# Altium schematic sheet Atomizer_medical.SchDoc
size A3
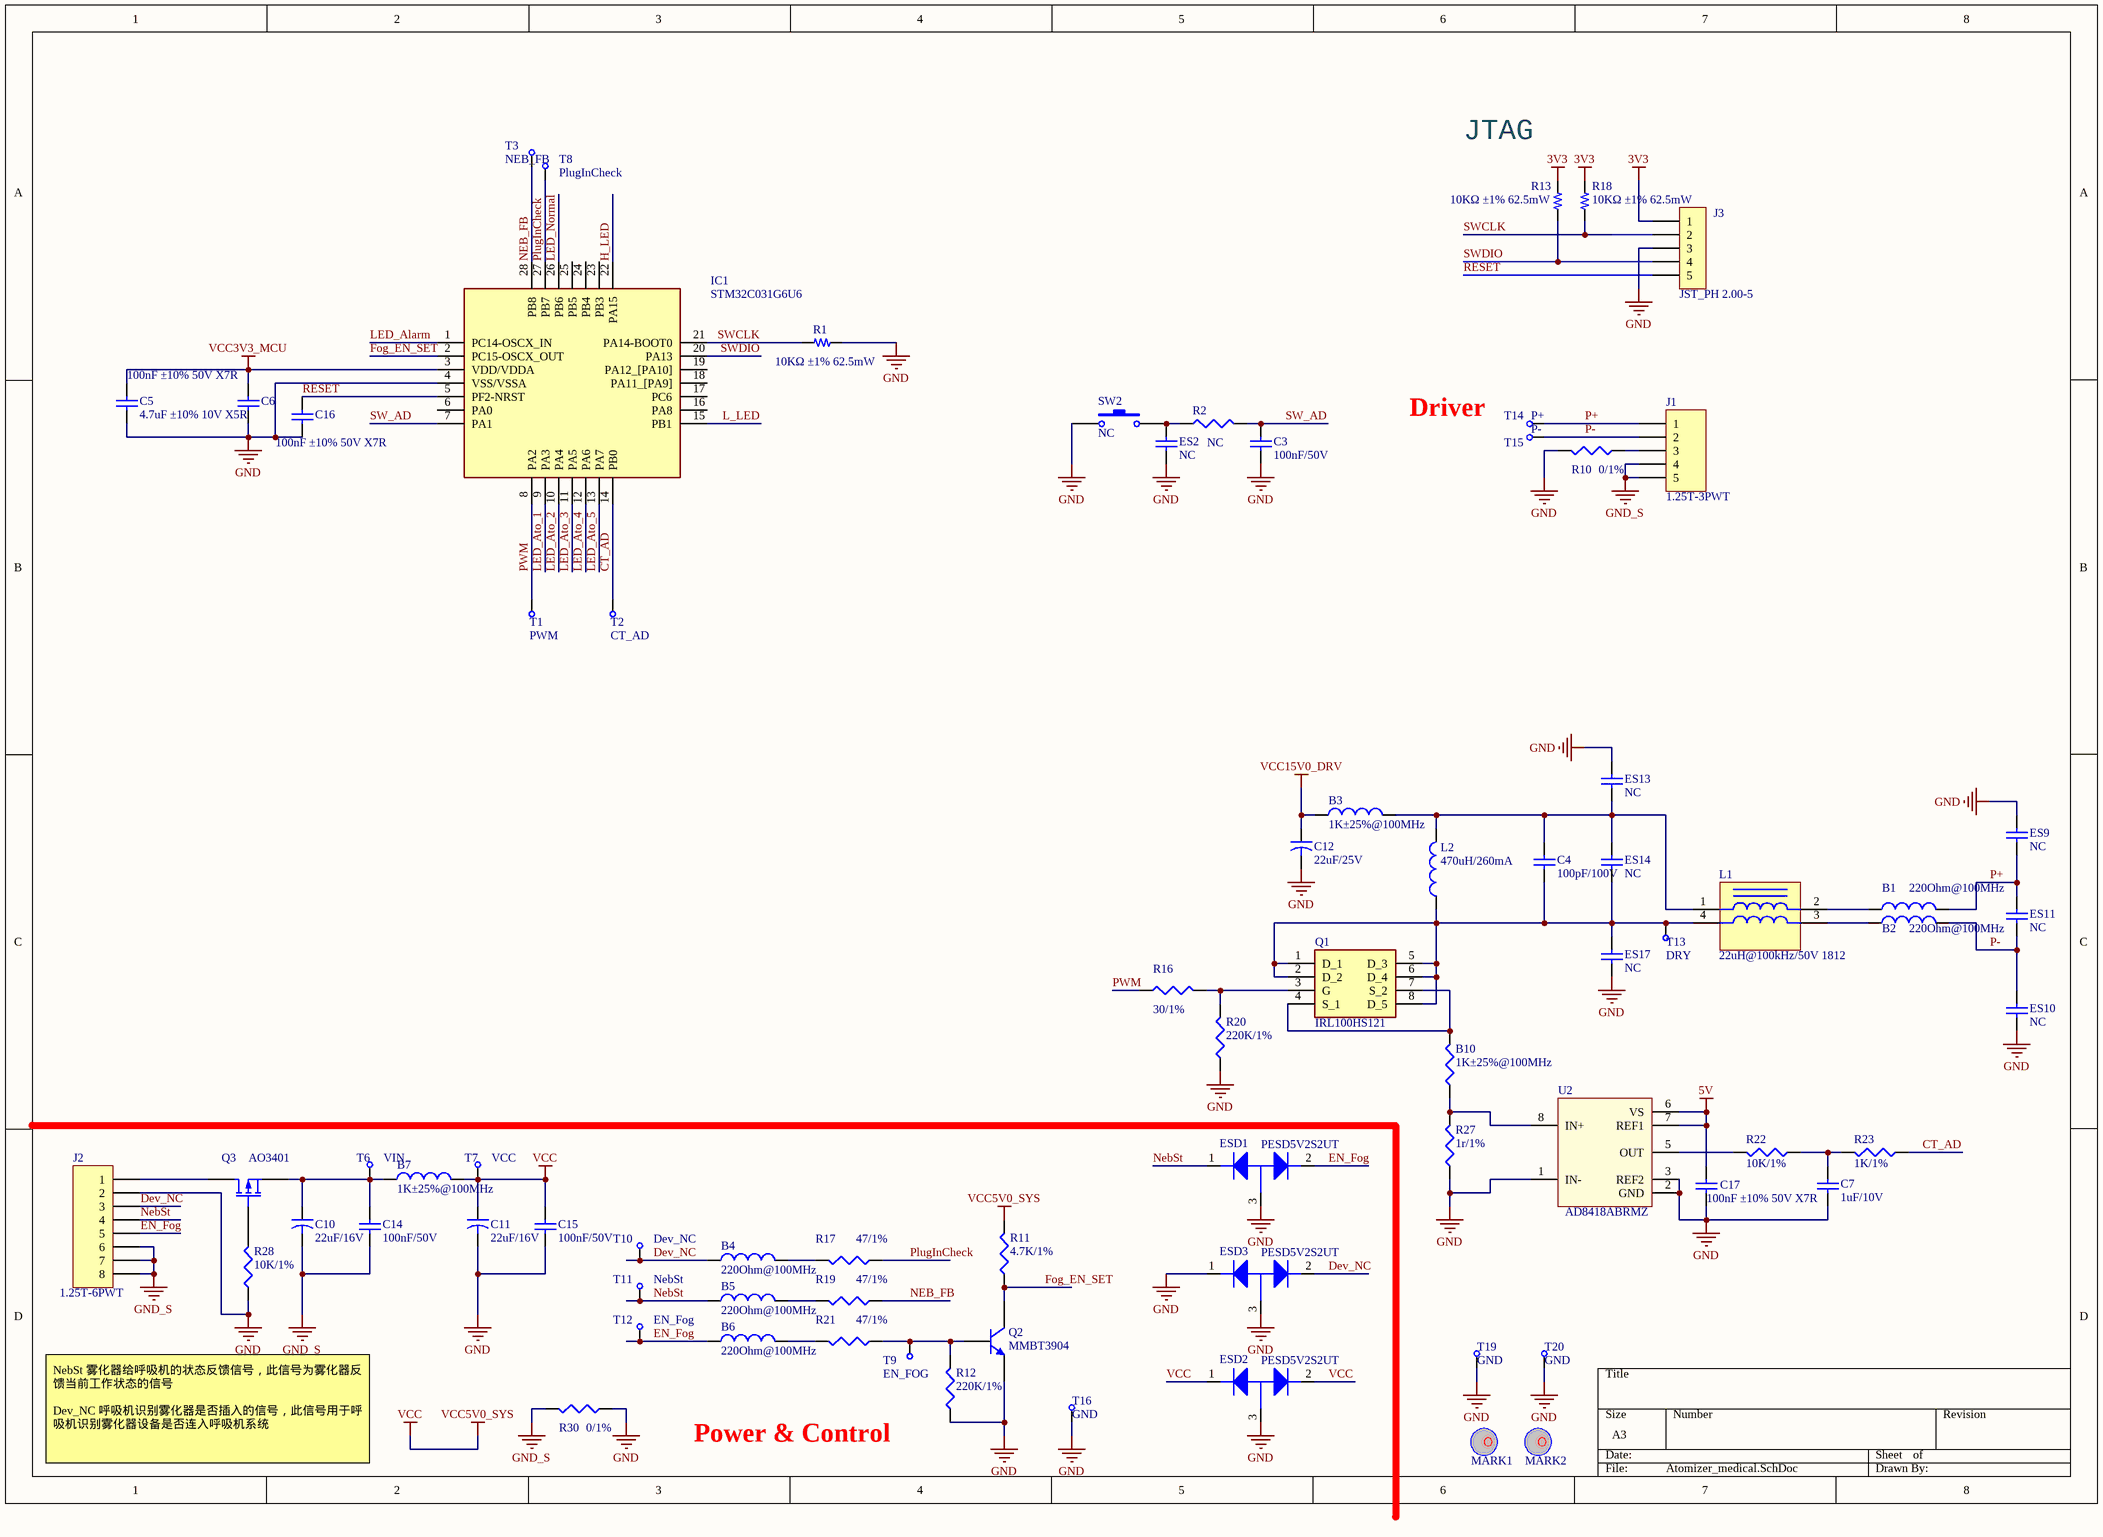
[diagram p0: Atomizer_medical.SchDoc]

## Parts
B1  220Ohm@100MHz  [0402-B]
B2  220Ohm@100MHz  [0402-B]
B3  1K±25%@100MHz  [0805-B]
B4  220Ohm@100MHz  [0402-B]
B5  220Ohm@100MHz  [0402-B]
B6  220Ohm@100MHz  [0402-B]
B7  1K±25%@100MHz  [0805-B]
B10  1K±25%@100MHz  [0603]
C3  100nF/50V  [0402-C]
C4  100pF/100V  [0805-C]
C5  4.7uF ±10% 10V X5R  [C0402]
C6  100nF ±10% 50V X7R  [C0402]
C7  1uF/10V  [0402-C]
C10  22uF/16V  [0805-C]
C11  22uF/16V  [0805-C]
C12  22uF/25V  [1206-C]
C14  100nF/50V  [0402-C]
C15  100nF/50V  [0402-C]
C16  100nF ±10% 50V X7R  [C0402]
C17  100nF ±10% 50V X7R  [C0402]
ES2  NC  [0402-C]
ES9  NC  [0402-C]
ES10  NC  [0402-C]
ES11  NC  [0402-C]
ES13  NC  [0402-C]
ES14  NC  [0402-C]
ES17  NC  [0402-C]
ESD1  PESD5V2S2UT  [SOT23]
ESD2  PESD5V2S2UT  [SOT23]
ESD3  PESD5V2S2UT  [SOT23]
IC1  STM32C031G6U6  [QFN50P400X400X60-28N-D]
J1  1.25T-3PWT  [WAFER_1.25MMX3P_180]
J2  1.25T-6PWT  [WAFER_1.25MMX6P_180]
J3  JST_PH 2.00-5  [JST_PH 2.00-5]
L1  22uH@100kHz/50V 1812  [LINEFILTER]
L2  470uH/260mA  [SP0502]
MARK1  MARK_POINT  [MARK_POINT]  (value not drawn)
MARK2  MARK_POINT  [MARK_POINT]  (value not drawn)
Q1  IRL100HS121  [IRL100HS121]
Q2  MMBT3904  [SOT23]
Q3  AO3401  [SOT23]
R1  10KΩ ±1% 62.5mW  [R0402]
R2  NC  [0402]
R10  0/1%  [0603]
R11  4.7K/1%  [0402]
R12  220K/1%  [0402]
R13  10KΩ ±1% 62.5mW  [R0402]
R16  30/1%  [0402]
R17  47/1%  [0402]
R18  10KΩ ±1% 62.5mW  [R0402]
R19  47/1%  [0402]
R20  220K/1%  [0402]
R21  47/1%  [0402]
R22  10K/1%  [0402]
R23  1K/1%  [0402]
R27  1r/1%  [0805]
R28  10K/1%  [0402]
R30  0/1%  [0603]
SW2  NC  [HTS-52MB]
T1  PWM  [TP-SIP-1-Small1]
T2  CT_AD  [TP-SIP-1-Small1]
T3  NEB_FB  [TP-SIP-1-Small1]
T6  VIN  [TP-SIP-1-Small1]
T7  VCC  [TP-SIP-1-Small1]
T8  PlugInCheck  [TP-SIP-1-Small1]
T9  EN_FOG  [TP-SIP-1-Small1]
T10  Dev_NC  [TP-SIP-1-Small1]
T11  NebSt  [TP-SIP-1-Small1]
T12  EN_Fog  [TP-SIP-1-Small1]
T13  DRY  [TP-SIP-1-Small1]
T14  P+  [TP-SIP-1-Small1]
T15  P-  [TP-SIP-1-Small1]
T16  GND  [TP-SIP-1-Small1]
T19  GND  [TP-SIP-1-Small1]
T20  GND  [TP-SIP-1-Small1]
U2  AD8418ABRMZ  [TSOP65P490X95-8N]

## Nets
3V3: J3.1 R13.2 R18.2
5V: C17.1 U2.6(VS) U2.7(REF1)
GND: C3.1 C5.1 C6.1 C7.2 C11.2 C12.2 C15.2 C16.1 C17.2 ES2.2 ES9.1 ES10.2 ES13.1 ES17.2 ESD1.3(G) ESD2.3(G) ESD3.1(S) ESD3.3(G) IC1.4(VSS/VSSA) J2.2 J3.3 Q2.2(E) R1.1 R10.2 R12.1 R20.1 R27.1 R28.1 R30.1 SW2.1 T16.1 T19.1 T20.1 U2.1(IN-) U2.2(GND) U2.3(REF2)
GND_S: C10.2 C14.2 J1.4 J1.5 J2.6 J2.7 J2.8 R30.2
VCC: B7.2 C11.1 C15.1 ESD2.1(S) ESD2.2(S) R11.2 T7.1  [also labelled VCC5V0_SYS]
VCC3V3_MCU: C5.2 C6.2 IC1.3(VDD/VDDA)
VCC15V0_DRV: B3.1 C12.1
CT_AD: IC1.14(PB0) R23.1 T2.1
Dev_NC: B4.1 ESD3.2(S) J2.3 T10.1
EN_Fog: B6.1 ESD1.2(S) J2.5 T12.1
Fog_EN_SET: IC1.2(PC15-OSCX_OUT) Q2.3(C) R11.1
H_LED: IC1.22(PA15)
L_LED: IC1.15(PB1)
LED_Alarm: IC1.1(PC14-OSCX_IN)
LED_Ato_1: IC1.9(PA3)
LED_Ato_2: IC1.10(PA4)
LED_Ato_3: IC1.11(PA5)
LED_Ato_4: IC1.12(PA6)
LED_Ato_5: IC1.13(PA7)
LED_Normal: IC1.26(PB6)
NEB_FB: IC1.28(PB8) R19.1 T3.1
NebSt: B5.1 ESD1.1(S) J2.4 T11.1
P+: B1.2 ES9.2 ES11.1 J1.1 T14.1
P-: B2.2 ES10.1 ES11.2 J1.2 T15.1
PlugInCheck: IC1.27(PB7) R17.1 T8.1
PWM: IC1.8(PA2) R16.1 T1.1
RESET: C16.2 IC1.5(PF2-NRST) J3.5
SW_AD: C3.2 IC1.7(PA1) R2.2
SWCLK: IC1.21(PA14-BOOT0) J3.2 R1.2 R18.1
SWDIO: IC1.20(PA13) J3.4 R13.1
NetB1_1: B1.1 L1.2
NetB2_1: B2.1 L1.3
NetB3_2: B3.2 C4.1 ES13.2 ES14.1 L1.1 L2.2
NetB4_2: B4.2 R17.2
NetB5_2: B5.2 R19.2
NetB6_2: B6.2 R21.2
NetB7_1: B7.1 C10.1 C14.1 Q3.3(S) T6.1
NetB10_1: B10.1 R27.2 U2.8(IN+)
NetB10_2: B10.2 Q1.4(S_1) Q1.7(S_2)
NetC4_2: C4.2 ES14.2 ES17.1 L1.4 L2.1 Q1.1(D_1) Q1.2(D_2) Q1.5(D_3) Q1.6(D_4) Q1.8(D_5) T13.1
NetC7_1: C7.1 R22.1 R23.2
NetES2_1: ES2.1 R2.1 SW2.2
NetJ1_3: J1.3 R10.1
NetJ2_1: J2.1 Q3.2(D)
NetQ1_3: Q1.3(G) R16.2 R20.2
NetQ2_1: Q2.1(B) R12.2 R21.1 T9.1
NetQ3_1: Q3.1(G) R28.2
NetR22_2: R22.2 U2.5(OUT)

Not connected (* = marked no-connect by the designer): IC1 6(PA0) 16(PA8) 17(PC6) 18(PA11_[PA9]) 19(PA12_[PA10]) 23(PB3) 24(PB4) 25(PB5)

## Notes on the sheet
- JTAG
- Driver
- NebSt 雾化器给呼吸机的状态反馈信号，此信号为雾化器反馈当前工作状态的信号
  Dev_NC 呼吸机识别雾化器是否插入的信号，此信号用于呼吸机识别雾化器设备是否连入呼吸机系统
- Power & Control

## Library data of the parts
B1-B7 L2 = Inductor: Code_IEC: 1005; Value: 10uH; Published: 8-Jun-2000; LatestRevisionDate: 29-May-2009; LatestRevisionNote: IPC-7351 Footprint Added.; PackageReference: 0402-A; Publisher: Altium Limited; PackageDescription: Chip Inductor; Code_JEITA: 0402
B10 R11 R12 R16 R17 R19-R23 R27 R28 = Res3: Resistor; Value: 1K; Published: 8-Jun-2000; LatestRevisionDate: 29-May-2009; LatestRevisionNote: IPC-7351 Footprint Added.; PackageReference: J1-0603; Publisher: Altium Limited; PackageDescription: Chip Resistor
C3 C4 C7 C14 C15 ES2 ES9-ES11 ES13 ES14 ES17 = Cap Semi: Capacitor (Semiconductor SIM Model); Value: 100pF; Published: 8-Jun-2000; LatestRevisionDate: 29-May-2009; LatestRevisionNote: IPC-7351 Footprint Added.; PackageReference: C1206; Publisher: Altium Limited; PackageDescription: Chip Capacitor
C5 = Cap: CL05A475KP5NRNC; Published: 8-Jun-2000; LatestRevisionDate: 17-Jul-2002; LatestRevisionNote: Re-released for DXP Platform.; PackageReference: RAD-0.3; Publisher: Altium Limited; PackageDescription: Radial Cap, Thru-Hole; 2 Leads; 0.3 in Pin Spacing
C6 C16 C17 = Cap: Capacitor; Published: 8-Jun-2000; LatestRevisionDate: 17-Jul-2002; LatestRevisionNote: Re-released for DXP Platform.; PackageReference: RAD-0.3; Publisher: Altium Limited; PackageDescription: Radial Cap, Thru-Hole; 2 Leads; 0.3 in Pin Spacing
C10-C12 = Cap2: Capacitor; Value: 100pF; Published: 23-Sep-2002; PackageReference: CAPR5-4X5; Publisher: Altium Limited; PackageDescription: Capacitor; 2 Leads
ESD1-ESD3 = ESD
IC1 = STM32C031G6U6: Integrated Circuit; Manufacturer_Name: STMicroelectronics; Datasheet Link: https://www.st.com/resource/en/datasheet/stm32c031c4.pdf; Height: 0.6mm; Manufacturer_Part_Number: STM32C031G6U6; Mouser Part Number: 511-STM32C031G6U6; Mouser Price/Stock: https://www.mouser.co.uk/ProductDetail/STMicroelectronics/STM32C031G6U6?qs=IPgv5n7u5QZqRf3nOTChhw%3D%3D
J1 = Header 5: Header, 5-Pin; LatestRevisionDate: 17-Jul-2002; LatestRevisionNote: Re-released for DXP Platform.; Publisher: Altium Limited
J2 = Header 8: Header, 8-Pin; LatestRevisionDate: 17-Jul-2002; LatestRevisionNote: Re-released for DXP Platform.; Publisher: Altium Limited
J3 = JST_PH 2.00-5: 品牌：JST 型号：B5B-PH-K-S，直插，间距2.00，5pin; 名称: 插座2针，2.0间距; 制造商: JST; 物料编号: B5B-PH-K-S
L1 = Inductor_common
Q1 = IRL100HS121: MOSFET (N-Channel); Manufacturer_Name: Infineon; Datasheet Link: https://www.infineon.com/dgdl/Infineon-IRL100HS121-DS-v02_01-EN.pdf?fileId=5546d46259d9a4bf015a4b31f85e118e; Height: 1mm; Manufacturer_Part_Number: IRL100HS121; Mouser Part Number: 726-IRL100HS121; Mouser Price/Stock: https://www.mouser.co.uk/ProductDetail/Infineon-Technologies/IRL100HS121?qs=xhbEVWpZdWcNYRrtYstvBg%3D%3D; Arrow Part Number: IRL100HS121; Arrow Price/Stock: https://www.arrow.com/en/products/irl100hs121/infineon-technologies-ag
Q2 = NPN: NPN Bipolar Transistor; Published: 8-Jun-2000; LatestRevisionDate: 17-Jul-2002; LatestRevisionNote: Re-released for DXP Platform.; PackageReference: TO-226-AA; Publisher: Altium Limited; PackageDescription: TO, Flat Index; 3 In-Line, Axial Leads; Body Dia. 4.8mm; Leads 0.55 x 0.51 mm (max); Code_JEDEC: TO-226-AA
Q3 = MOSFET-P: P-Channel MOSFET; Published: 8-Jun-2000; LatestRevisionDate: 17-Jul-2002; LatestRevisionNote: Re-released for DXP Platform.; PackageVersion: 1995/1996; PackageReference: E3; Publisher: Altium Limited; PackageDescription: TO, Flat Index; 3 In-Line, Axial Leads; Body Dia. 4.6mm; Lead Dia. 0.5 mm (max)
R1 R13 R18 = R-0603
R2 = Res3: Resistor; Value: 4.7K; Published: 8-Jun-2000; LatestRevisionDate: 29-May-2009; LatestRevisionNote: IPC-7351 Footprint Added.; PackageReference: J1-0603; Publisher: Altium Limited; PackageDescription: Chip Resistor
R10 R30 = Res3: Resistor; Value: 0; Published: 8-Jun-2000; LatestRevisionDate: 29-May-2009; LatestRevisionNote: IPC-7351 Footprint Added.; PackageReference: J1-0603; Publisher: Altium Limited; PackageDescription: Chip Resistor
SW2 = SW-PB: Switch; Published: 24-Mar-1999; LatestRevisionDate: 17-Jul-2002; LatestRevisionNote: Re-released for DXP Platform.; PackageReference: SPST-2; Publisher: Altium Limited; PackageDescription: Switch; 2 Leads
T1-T3 T6-T16 T19 T20 = TP-SIP-1-Small
U2 = AD8418: 品牌：ADI，型号：AD8418ABRMZ，ROHS; Manufacturer: Analog Devices; Id: 50496; Value: CMVR=70V; Part Number: AD8418ABRMZ; Type: DIFAMP; HelpURL: http://www.analog.com/media/en/technical-documentation/data-sheets/AD8418A.pdf